# EAGLE design H11L1 (EAGLE 6.3)
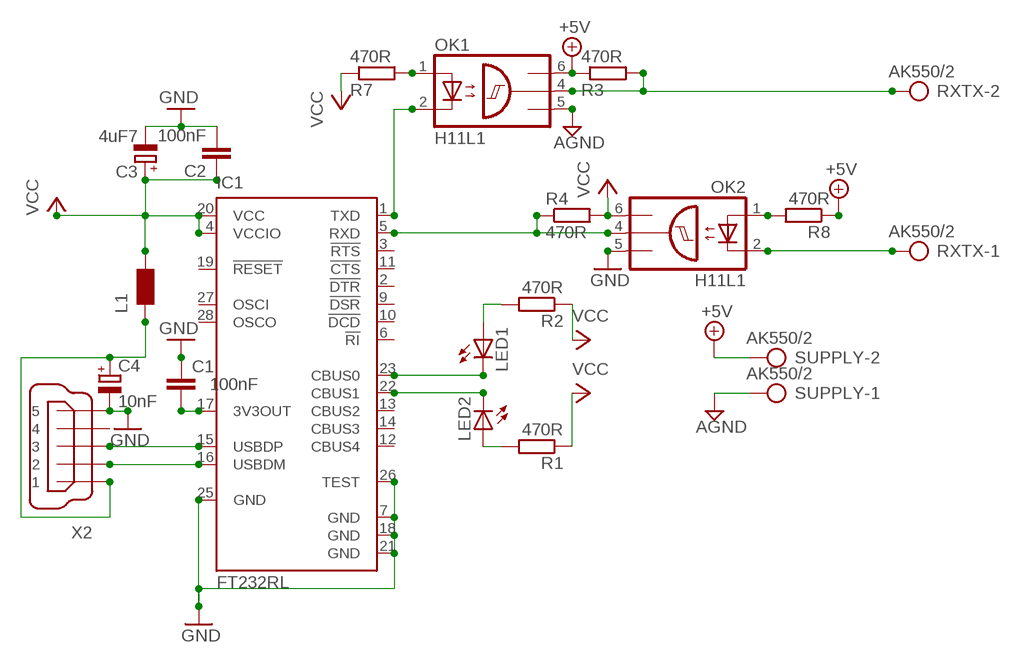
[diagram p0: schematic, sheet 1]

## Parts
C1  100nF  C-EUC1206K  [C1206K]
C2  100nF  C-EUC1206K  [C1206K]
C3  4uF7  CPOL-EU140CLH-0810  [140CLH-0810]
C4  10nF  CPOL-EU153CLV-0405  [153CLV-0405]
IC1  FT232RL  [SSOP28]
L1  WE-CBF_1206  [1206]
LED1  LEDCHIPLED_1206  [CHIPLED_1206]
LED2  LEDCHIPLED_1206  [CHIPLED_1206]
OK1  H11L1  OPI8013  [DIL06]
OK2  H11L1  OPI8013  [DIL06]
R1  470R  R-EU_M1206  [M1206]
R2  470R  R-EU_M1206  [M1206]
R3  470R  R-EU_M1206  [M1206]
R4  470R  R-EU_M1206  [M1206]
R7  470R  R-EU_M1206  [M1206]
R8  470R  R-EU_M1206  [M1206]
RXTX  AK550/2  [AK550/2]
SUPPLY  AK550/2  [AK550/2]
X2  MINI-USB-SHIELD-UX60A-MB-5ST  [UX60A-MB-5ST]

## Nets
+5V: OK1.6(VCC) R3.1 R8.1 SUPPLY.2
AGND: OK1.5(GND) SUPPLY.1
GND: C1.1 C2.2 C3.- C4.- IC1.7(GND) IC1.18(GND) IC1.21(GND) IC1.25(GND) IC1.26(TEST) OK2.5(GND) X2.5
N$1: IC1.16(USBDM) X2.2
N$2: IC1.15(USBDP) X2.3
N$3: LED1.A R2.2
N$5: C1.2 IC1.17(3V3OUT)
N$6: LED2.A R1.2
N$7: IC1.23(CBUS0) LED1.C
N$8: IC1.22(CBUS1) LED2.C
N$9: C4.+ L1.1 X2.1
N$10: OK1.4(OUT) R3.2 RXTX.2
N$11: IC1.5(RXD) OK2.4(OUT) R4.1
N$14: OK1.1(A) R7.2
N$15: OK2.1(A) R8.2
N$19: OK2.2(C) RXTX.1
N$44: IC1.1(TXD) OK1.2(C)
VCC: C2.1 C3.+ IC1.4(VCCIO) IC1.20(VCC) L1.2 OK2.6(VCC) R1.1 R2.1 R4.2 R7.1
Unconnected: IC1.2(!DTR) IC1.3(!RTS) IC1.6(!RI) IC1.9(!DSR) IC1.10(!DCD) IC1.11(!CTS) IC1.12(CBUS4) IC1.13(CBUS2) IC1.14(CBUS3) IC1.19(!RESET) IC1.27(OSCI) IC1.28(OSCO) X2.4 X2.M1(S1) X2.M2(S2) X2.M3(S3) X2.M4(S4)

## Library data of the parts
C1 C2 = rcl:C-EU: CAPACITOR, European symbol
C3 C4 = rcl:CPOL-EU: POLARIZED CAPACITOR, European symbol
IC1 = ftdichip:FT232R: Source: http://www.ftdichip.com/Documents/DataSheets/DS_FT232R_v104.pdf
L1 = wuerth-elektronik:WE-CBF: SMD EMI Suppression Ferrite Beads - excellent anti-EMI properties - low DCR - impedances till 3000 ohms - rated current up to 6 A
LED1 LED2 = led:LED: LED OSRAM: - CHIPLED LG R971, LG N971, LY N971, LG Q971, LY Q971, LO R971, LY R971 LH N974, LH R974 LS Q976, LO Q976, LY Q976 LO Q996 - Hyper CHIPLED LW Q18S LB Q993, LB Q99A, LB R99A - SideLED LS A670, LO A670, LY A670, LG A670, LP A670 LB A673, LV A673, LT A673, LW A673 LH A674 LY A675 LS A676, LA A676, LO A676, LY A676, LW A676 LS A679, LY A679, LG A679 - Hyper Micro SIDELED® LS Y876, LA Y876, LO Y876, LY Y876 LT Y87S - SmartLED LW L88C, LW L88S LB L89C, LB L89S, LG L890 LS L89K, LO L89K, LY L89K LS L896, LA L896, LO L896, LY L896 - TOPLED LS T670, LO T670, LY T670, LG T670, LP T670 LSG T670, LSP T670, LSY T670, LOP T670, LYG T670 LG T671, LOG T671, LSG T671 LB T673, LV T673, LT T673, LW T673 LH T674 LS T676, LA T676, LO T676, LY T676, LB T676, LH T676, LSB T676, LW T676 LB T67C, LV T67C, LT T67C, LS T67K, LO T67K, LY T67K, LW E67C LS E67B, LA E67B, LO E67B, LY E67B, LB E67C, LV E67C, LT E67C LW T67C LS T679, LY T679, LG T679 LS T770, LO T770, LY T770, LG T770, LP T770 LB T773, LV T773, LT T773, LW T773 LH T774 LS E675, LA E675, LY E675, LS T675 LS T776, LA T776, LO T776, LY T776, LB T776 LHGB T686 LT T68C, LB T68C - Hyper Mini TOPLED® LB M676 - Mini TOPLED Santana® LG M470 LS M47K, LO M47K, LY M47K Source: http://www.osram.convergy.de - LUMILED® LXK2-PW12-R00, LXK2-PW12-S00, LXK2-PW14-U00, LXK2-PW14-V00 LXK2-PM12-R00, LXK2-PM12-S00, LXK2-PM14-U00 LXK2-PE12-Q00, LXK2-PE12-R00, LXK2-PE12-S00, LXK2-PE14-T00, LXK2-PE14-U00 LXK2-PB12-K00, LXK2-PB12-L00, LXK2-PB12-M00, LXK2-PB14-N00, LXK2-PB14-P00, LXK2-PB14-Q00 LXK2-PR12-L00, LXK2-PR12-M00, LXK2-PR14-Q00, LXK2-PR14-R00 LXK2-PD12-Q00, LXK2-PD12-R00, LXK2-PD12-S00 LXK2-PH12-R00, LXK2-PH12-S00 LXK2-PL12-P00, LXK2-PL12-Q00, LXK2-PL12-R00 Source: www.luxeon.com
OK1 OK2 = optocoupler:OPI8013: OPTO COUPLER
R1-R4 R7 R8 = resistor:R-EU_: RESISTOR, European symbol
RXTX SUPPLY = con-ptr500:AK550/2: CONNECTOR
X2 = con-hirose:MINI-USB-SHIELD-: MINI USB Connector Source: http://www.hirose.co.jp/cataloge_hp/e24000019.pdf

## Board
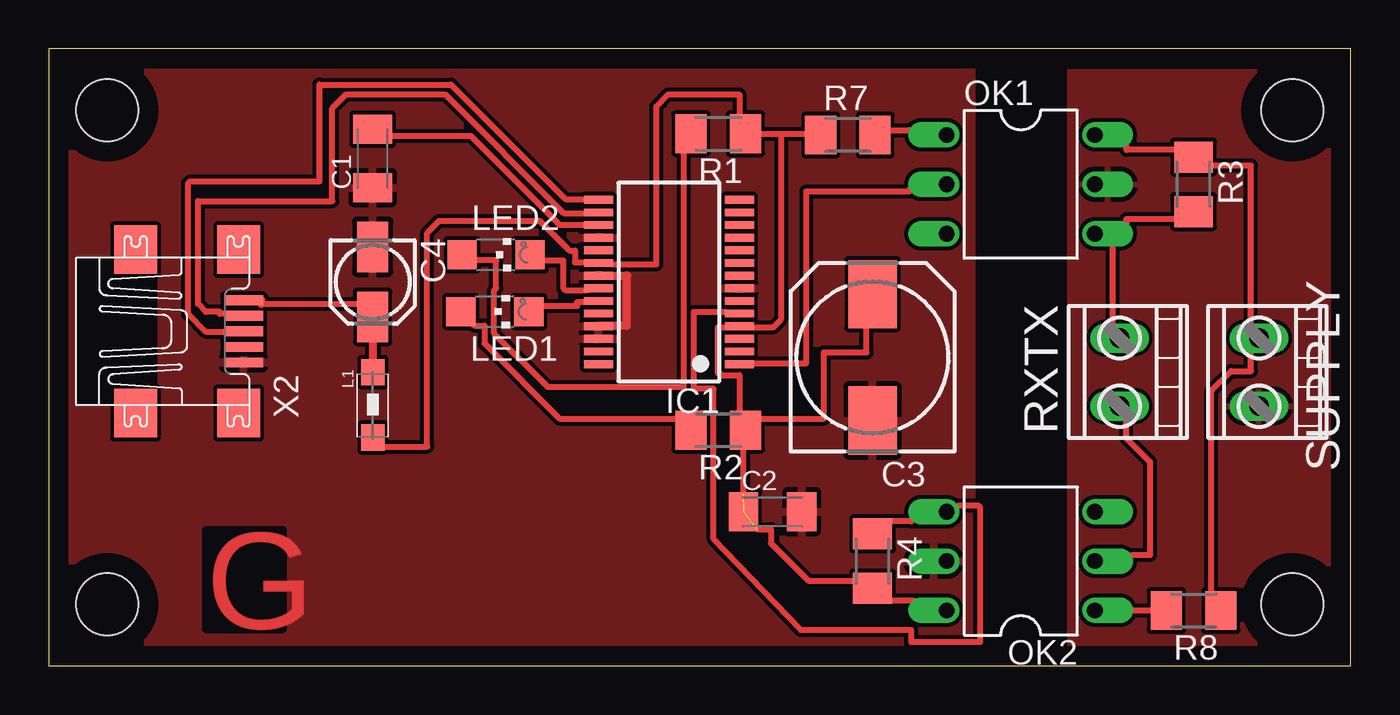
[diagram p1: board, top side]

Size 66.98 x 31.74 mm. Coordinates in mm from the lower left corner, seen from the top.
Outline: 0,0 66.98,0 66.98,31.74 0,31.74 0,0
Copper layers (1*16): Top 0.035mm / dielectric 1.5mm / Bottom 0.035mm
Design rules "default *": minimum track width 12mil, minimum drill 0.6mm, track to track 8mil, track to pad 8mil, pad to pad 8mil, via to via 8mil, smd to smd 8mil, copper to edge 40mil, drill to drill 10mil, minimum pad ring 10mil, minimum via ring 8mil, stop-mask expansion 4mil, vias tented up to drill 0mil, thermal gap 10mil
Holes 3.2 mm at 63.97,28.57 63.97,3.17 3.01,3.17 3.01,28.57

### Footprints (pad centres in the part's own frame; a part is rotated, then mirrored left to right if it is on the bottom)
C1206K = smd 1.5 x 2: 1 -1.5,0; 2 1.5,0
140CLH-0810 = smd 3.5 x 2.5: + 3.25,0; - -3.25,0
153CLV-0405 = smd 2.6 x 1.6: + 1.8,0; - -1.8,0
SSOP28 = smd 0.4 x 1.5: 1 -4.225,-3.625; 2 -3.575,-3.625; 3 -2.925,-3.625; 4 -2.275,-3.625; 5 -1.625,-3.625; 6 -0.975,-3.625; 7 -0.325,-3.625; 8 0.325,-3.625; 9 0.975,-3.625; 10 1.625,-3.625; 11 2.275,-3.625; 12 2.925,-3.625; 13 3.575,-3.625; 14 4.225,-3.625; 15 4.225,3.625; 16 3.575,3.625; 17 2.925,3.625; 18 2.275,3.625; 19 1.625,3.625; 20 0.975,3.625; 21 0.325,3.625; 22 -0.325,3.625; 23 -0.975,3.625; 24 -1.625,3.625; 25 -2.275,3.625; 26 -2.925,3.625; 27 -3.575,3.625; 28 -4.225,3.625
1206 = smd 1.35 x 1.2: 1 -1.7,0; 2 1.65,0
CHIPLED_1206 = smd 1.5 x 1.5: A 0,-1.75; C 0,1.75
DIL06 = drill 0.813 offset: 1 -2.54,-3.81; 2 0,-3.81; 3 2.54,-3.81; 4 2.54,3.81; 5 0,3.81; 6 -2.54,3.81
M1206 = smd 1.6 x 2: 1 -1.4,0; 2 1.4,0
AK550/2 = drill 1 pad 1.5 long: 1 -1.75,0; 2 1.75,0
UX60A-MB-5ST = smd 2 x 0.5: 1 2.25,1.6; 2 2.25,0.8; 3 2.25,0; 4 2.25,-0.8; 5 2.25,-1.6 | smd 2.2 x 2.5: M1 -3.3,-4.2; M2 -3.3,4.2; M3 2,4.2; M4 2,-4.2

### Placement (x,y rotation side)
C1  16.66,26.09 90 top
C2  37.24,7.93 0 top
C3  42.38,15.87 90 top
C4  16.66,19.74 270 top
IC1  31.9,19.74 90 top
L1  16.67,13.39 270 top
LED1  22.95,18.22 270 top
LED2  23.01,21.14 270 top
OK1  50,24.76 270 top
OK2  50,5.39 90 top
R1  34.44,27.36 180 top
R2  34.44,12.12 180 top
R3  58.89,24.76 270 top
R4  42.38,5.39 270 top
R7  41.11,27.3 0 top
R8  58.89,2.85 180 top
RXTX  55.08,15.11 90 top
SUPPLY  62.26,15.11 90 top
X2  7.77,17.2 0 top

### Tracks (layer width: path | path; a pad name or v marks a point on that pad's centre or on a via)
+5V
  Top 0.305: OK1.6 55.44,26.74 55.44,26.54 57.98,26.54 R3.1 59.8,25.72 61.84,25.72 61.84,17.6 SUPPLY.2 61.84,16.18 61.84,15.16 60.82,15.16 59.8,14.14 59.8,3.78 R8.1
AGND
  pour Top: 52.54,31.11 66.51,31.11 66.51,0.63 52.54,0.63
GND
  Top 0.305: 29.22,17.47 29.02,17.5 IC1.25 | IC1.21 29.02,20.04 29.2,20.07
  Top 0.406: IC1.21 29.75,20.07 29.75,20.08 29.73,20.08 29.73,17.49 28.28,17.49 IC1.25
  pour Top: 0.47,31.11 47.46,31.11 47.46,0.63 0.47,0.63
N$1
  Top 0.305: IC1.16 27.6,23.29 26.48,23.29 20.38,29.38 15.3,29.38 14.59,28.67 14.59,23.9 7.68,23.9 7.68,18.61 8.09,18.21 8.8,18.21 8.8,18.11 9.11,18.11 X2.2
N$2
  Top 0.305: IC1.15 27.6,24 26.58,24 20.69,29.89 13.93,29.89 13.93,24.91 7.28,24.91 7.18,24.81 7.18,18.11 8.09,17.19 9.11,17.19 X2.3
N$3
  Top 0.305: LED1.A 21.91,17.5 22.42,17.5 22.42,16.58 26.28,12.72 32.27,12.72 R2.2
N$5
  Top 0.305: IC1.17 27.6,22.68 26.27,22.68 26.18,22.78 26.17,22.78 21.7,27.25 17.64,27.25 C1.2
N$6
  Top 0.305: LED2.A 22.01,20.85 23.02,20.85 23.02,19.43 22.92,19.32 22.92,17.09 25.67,14.35 32.68,14.35 32.68,26.44 R1.2
N$7
  Top 0.305: LED1.C 25.36,18.51 27.19,18.51 27.19,18.71 27.6,18.71 IC1.23
N$8
  Top 0.305: LED2.C 25.46,20.85 26.47,20.85 26.47,19.43 26.58,19.32 27.6,19.32 IC1.22
N$9
  Top 0.305: 10.94,18.61 15.91,18.61 C4.+
  Top 0.406: X2.1 10.94,18.8 10.94,18.61 | C4.+ 16.67,17.94 L1.1
N$10
  Top 0.305: R3.2 57.98,22.98 55.44,22.98 55.44,22.78 OK1.4 54.72,21.66 54.72,17.6 RXTX.2
N$11
  Top 0.305: R4.1 43.34,7.44 44.36,7.44 44.36,7.54 OK2.4 46.8,8.25 47.82,8.25 47.92,8.15 47.92,1.24 44.36,1.24 44.36,1.85 38.67,1.85 34.2,6.52 34.2,14.24 33.19,14.24 33.19,18.21 34.81,18.21 IC1.5
N$14
  Top 0.305: R7.2 43.24,27.55 44.26,27.55 OK1.1
N$15
  Top 0.305: R8.2 56.76,2.86 55.74,2.86 OK2.1
N$19
  Top 0.305: OK2.2 55.74,5.71 56.66,5.71 56.66,10.49 55.44,11.7 55.44,12.62 RXTX.1
N$44
  Top 0.305: IC1.1 36.23,15.57 38.97,15.57 38.97,24.4 44.26,24.4 44.26,24.51 OK1.2
VCC  (2 unrouted)
  Top 0.305: 37.66,27.35 36.64,27.35 R1.1 35.52,28.27 35.52,29.38 31.86,29.38 31.25,28.77 31.25,20.64 29.02,20.64 IC1.20 27.6,20.75 27.07,20.75 27.07,21.36 26.79,21.36 25.26,22.88 | 37.66,27.35 38.98,27.35 R7.1 | R2.1 35.52,13.03 35.52,14.96 34.51,14.96 34.51,15.06 34.4,15.06 34.4,17.39 34.81,17.39 IC1.4 36.23,17.39 37.25,17.39 37.66,17.8 37.66,27.35 | 42.07,19.12 42.07,16.12 39.87,16.12 39.87,12.72 36.64,12.72 R2.1 | OK2.6 44.46,3.37 43.34,3.37 R4.2 41.41,4.39 39.08,4.39 37.15,6.32 37.15,7.03 36.44,7.03 | 35.73,8.86 35.73,11.2 R2.1 | 25.26,22.88 | 25.26,22.88 20.08,22.88 19.47,22.27 19.47,11.28 16.67,11.28 L1.2
  Top 0.406: 42.07,19.12 C3.+

### Text on the board
Top: G